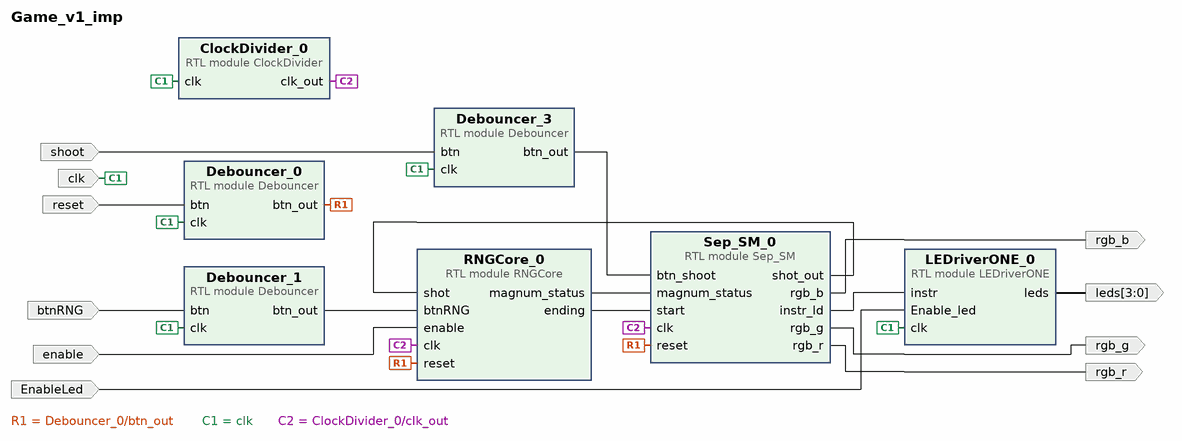
[diagram p0: block diagram of the top level]
# Vivado block design Game_v1_imp, xc7z010clg400-1, Vivado 2020.1
create_bd_design Game_v1_imp

create_bd_port -dir I -type clk clk
set_property -dict {CONFIG.FREQ_HZ 125000000} [get_bd_ports clk]
create_bd_port -dir I enable
create_bd_port -dir O rgb_r
create_bd_port -dir O rgb_b
create_bd_port -dir O rgb_g
create_bd_port -dir I reset
create_bd_port -dir I btnRNG
create_bd_port -dir I shoot
create_bd_port -dir O -from 3 -to 0 leds
create_bd_port -dir I EnableLed

create_bd_cell -type module -reference RNGCore RNGCore_0
create_bd_cell -type module -reference Debouncer Debouncer_0
create_bd_cell -type module -reference ClockDivider ClockDivider_0
set_property -dict {CONFIG.FREQ_DES 100} [get_bd_cells ClockDivider_0]
create_bd_cell -type module -reference Debouncer Debouncer_1
create_bd_cell -type module -reference Debouncer Debouncer_3
create_bd_cell -type module -reference Sep_SM Sep_SM_0
create_bd_cell -type module -reference LEDriverONE LEDriverONE_0

# ---- connections ----

connect_bd_net [get_bd_pins Debouncer_0/btn_out] [get_bd_pins RNGCore_0/reset] [get_bd_pins Sep_SM_0/reset]
connect_bd_net [get_bd_pins Debouncer_1/btn_out] [get_bd_pins RNGCore_0/btnRNG]
connect_bd_net [get_bd_pins Debouncer_3/btn_out] [get_bd_pins Sep_SM_0/btn_shoot]
connect_bd_net [get_bd_pins RNGCore_0/magnum_status] [get_bd_pins Sep_SM_0/magnum_status]
connect_bd_net [get_bd_pins RNGCore_0/ending] [get_bd_pins Sep_SM_0/start]
connect_bd_net [get_bd_pins Sep_SM_0/shot_out] [get_bd_pins RNGCore_0/shot]
connect_bd_net [get_bd_ports clk] \
  [get_bd_pins Debouncer_0/clk] [get_bd_pins ClockDivider_0/clk] [get_bd_pins Debouncer_1/clk] [get_bd_pins Debouncer_3/clk] \
  [get_bd_pins LEDriverONE_0/clk]
connect_bd_net [get_bd_ports enable] [get_bd_pins RNGCore_0/enable]
connect_bd_net [get_bd_pins Sep_SM_0/rgb_r] [get_bd_ports rgb_r]
connect_bd_net [get_bd_pins Sep_SM_0/rgb_g] [get_bd_ports rgb_g]
connect_bd_net [get_bd_pins Sep_SM_0/rgb_b] [get_bd_ports rgb_b]
connect_bd_net [get_bd_ports reset] [get_bd_pins Debouncer_0/btn]
connect_bd_net [get_bd_ports btnRNG] [get_bd_pins Debouncer_1/btn]
connect_bd_net [get_bd_ports shoot] [get_bd_pins Debouncer_3/btn]
connect_bd_net [get_bd_pins Sep_SM_0/instr_ld] [get_bd_pins LEDriverONE_0/instr]
connect_bd_net [get_bd_pins LEDriverONE_0/leds] [get_bd_ports leds]
connect_bd_net [get_bd_pins ClockDivider_0/clk_out] [get_bd_pins RNGCore_0/clk] [get_bd_pins Sep_SM_0/clk]
connect_bd_net -net Enable_led_0_1 [get_bd_ports EnableLed] [get_bd_pins LEDriverONE_0/Enable_led]

validate_bd_design
save_bd_design
